# EAGLE schematic SlowStart (EAGLE 6.5.0)
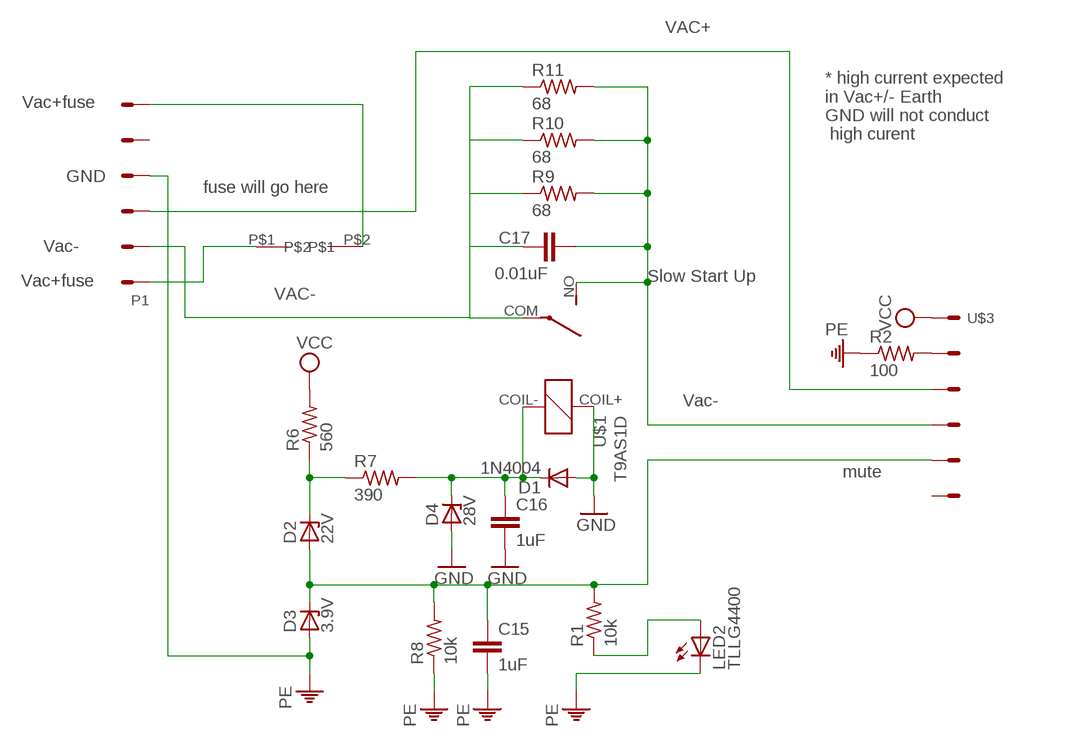
[diagram p0: schematic, sheet 1]

## Parts
C15  1uF  C-EU025-060X050  [C025-060X050]
C16  1uF  C-EU025-060X050  [C025-060X050]
C17  0.01uF  C-EU025-060X050  [C025-060X050]
D1  1N4004  [DO41-10]
D2  22V  ZENER-DIODEP1-12  [P1Z12]
D3  3.9V  ZENER-DIODEDO34-7  [DO34Z7]
D4  28V  ZENER-DIODEP1-12  [P1Z12]
LED2  TLLG4400  [LED3MM]
P1  MOLEX_6P  [MOLEX_6P]
R1  10k  R-US_0207/15  [0207/15]
R2  100  R-US_0207/15  [0207/15]
R6  560  R-US_0207/15  [0207/15]
R7  390  R-US_0207/15  [0207/15]
R8  10k  R-US_0207/15  [0207/15]
R9  68  R-US_0617/22  [0617/22]
R10  68  R-US_0617/22  [0617/22]
R11  68  R-US_0617/22  [0617/22]
U$1  T9AS1D  [RELAY_CM]
U$3  MOLEX_6P  [MOLEX_6P]
U$4  FUSE  [FUSE_PADS]

## Nets
GND: C15.2 C16.2 D1.A D3.A D4.A LED2.K(C) P1.P$4(S3) R2.1 R8.1 U$1.COIL+ ; supply symbol labelled PE
N$1: P1.P$1(S) U$4.P$1
N$4: LED2.A R1.1
N$5: R2.2 U$3.P$2(S1)
N$6: P1.P$6(S5) U$4.P$2
N$8: C17.2 R9.2 R10.2 R11.2 U$1.NO U$3.P$4(S3)
N$10: C16.1 D1.C D4.C R7.2 U$1.COIL-
N$11: D2.C R6.1 R7.1
N$12: C15.1 D2.A D3.C R1.2 R8.2 U$3.P$5(S4)
VAC+: P1.P$3(S2) U$3.P$3(S2)
VAC-: C17.1 P1.P$2(S1) R9.1 R10.1 R11.1 U$1.COM
VCC: R6.2 U$3.P$1(S)
Unconnected: P1.P$5(S4) U$3.P$6(S5)

## Notes on the sheet
- Vac+fuse
- * high current expected 
  in Vac+/- Earth 
  GND will not conduct
   high curent
- GND
- fuse will go here
- Vac-
- Vac+fuse | Slow Start Up
- Vac-
- mute

## Library data of the parts
C15-C17 = rcl:C-EU: CAPACITOR, European symbol
D1 = diode:1N4004: DIODE general purpose rectifier, 1 A
D2-D4 = diode:ZENER-DIODE: Z-Diode
LED2 = led:TLLG4400: Low Current (2mA) LED 3 mm Tinted Diffused Package color GREEN Source: Data sheet <http://www.farnell.com/datasheets/391098.pdf>; MF: VISHAY SEMICONDUCTOR; OC_FARNELL: 1612435
P1 U$3 = Amplifier_Parts:MOLEX_6P
R1 R2 R6-R8 = resistor:R-US_: RESISTOR, American symbol
R9-R11 = rcl:R-US_: RESISTOR, American symbol
U$1 = Amplifier_Parts:T9AS1D
U$4 = Amplifier_Parts:FUSE